# EAGLE schematic LM2597 (EAGLE 6.2)
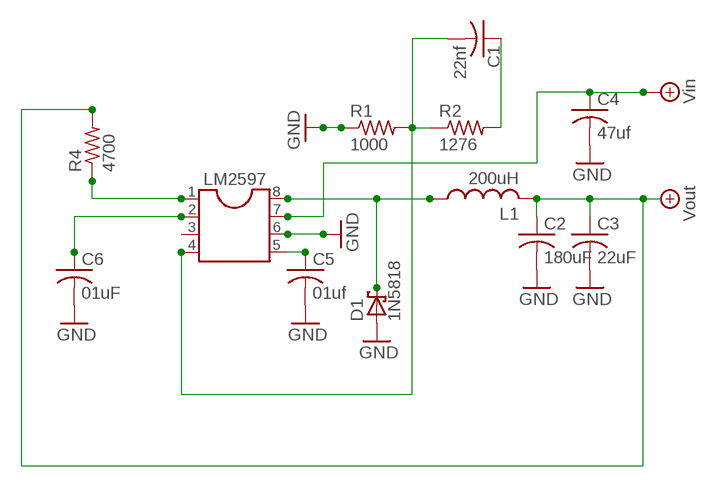
[diagram p0: schematic, sheet 1]

## Parts
C1  22nf  C-US050-025X075  [C050-025X075]
C2  180uF  C-US050-025X075  [C050-025X075]
C3  22uF  C-US050-025X075  [C050-025X075]
C4  47uf  C-US050-025X075  [C050-025X075]
C5  01uf  C-US050-025X075  [C050-025X075]
C6  01uF  C-US050-025X075  [C050-025X075]
D1  1N5818  1N5908  [C4111-15]
L1  200uH  L-USL1812  [L1812]
LM2597  DIL8  [DIL08]
R1  1000  R-US_0414/15  [0414/15]
R2  1276  R-US_0414/15  [0414/15]
R4  4700  R-US_0414/15  [0414/15]

## Nets
GND: C2.2 C3.2 C4.2 C5.2 C6.2 D1.A LM2597.6 R1.1
N$1: LM2597.1 R4.1
N$2: C6.1 LM2597.2
N$3: C1.2 LM2597.4 R1.2
N$4: D1.C L1.1 LM2597.8
N$5: C5.1 LM2597.5
N$6: C2.1 C3.1 L1.2 ; supply symbol labelled Vout
N$7: C1.1 R2.2
N$8: C4.1 LM2597.7 ; supply symbol labelled Vin
N$9: R4.2
Unconnected: LM2597.3 R2.1

## Library data of the parts
C1-C6 = resistor:C-US: CAPACITOR, American symbol
D1 = diode:1N5908: DIODE schottky
L1 = resistor:L-US: INDUCTOR, American symbol
LM2597 = ic-package:DIL8: Dual In Line / Socket
R1 R2 R4 = resistor:R-US_: RESISTOR, American symbol